# Altium schematic sheet G11_Main.SCHDOC
size A3; SheetNumber: 0; SheetTotal: 0
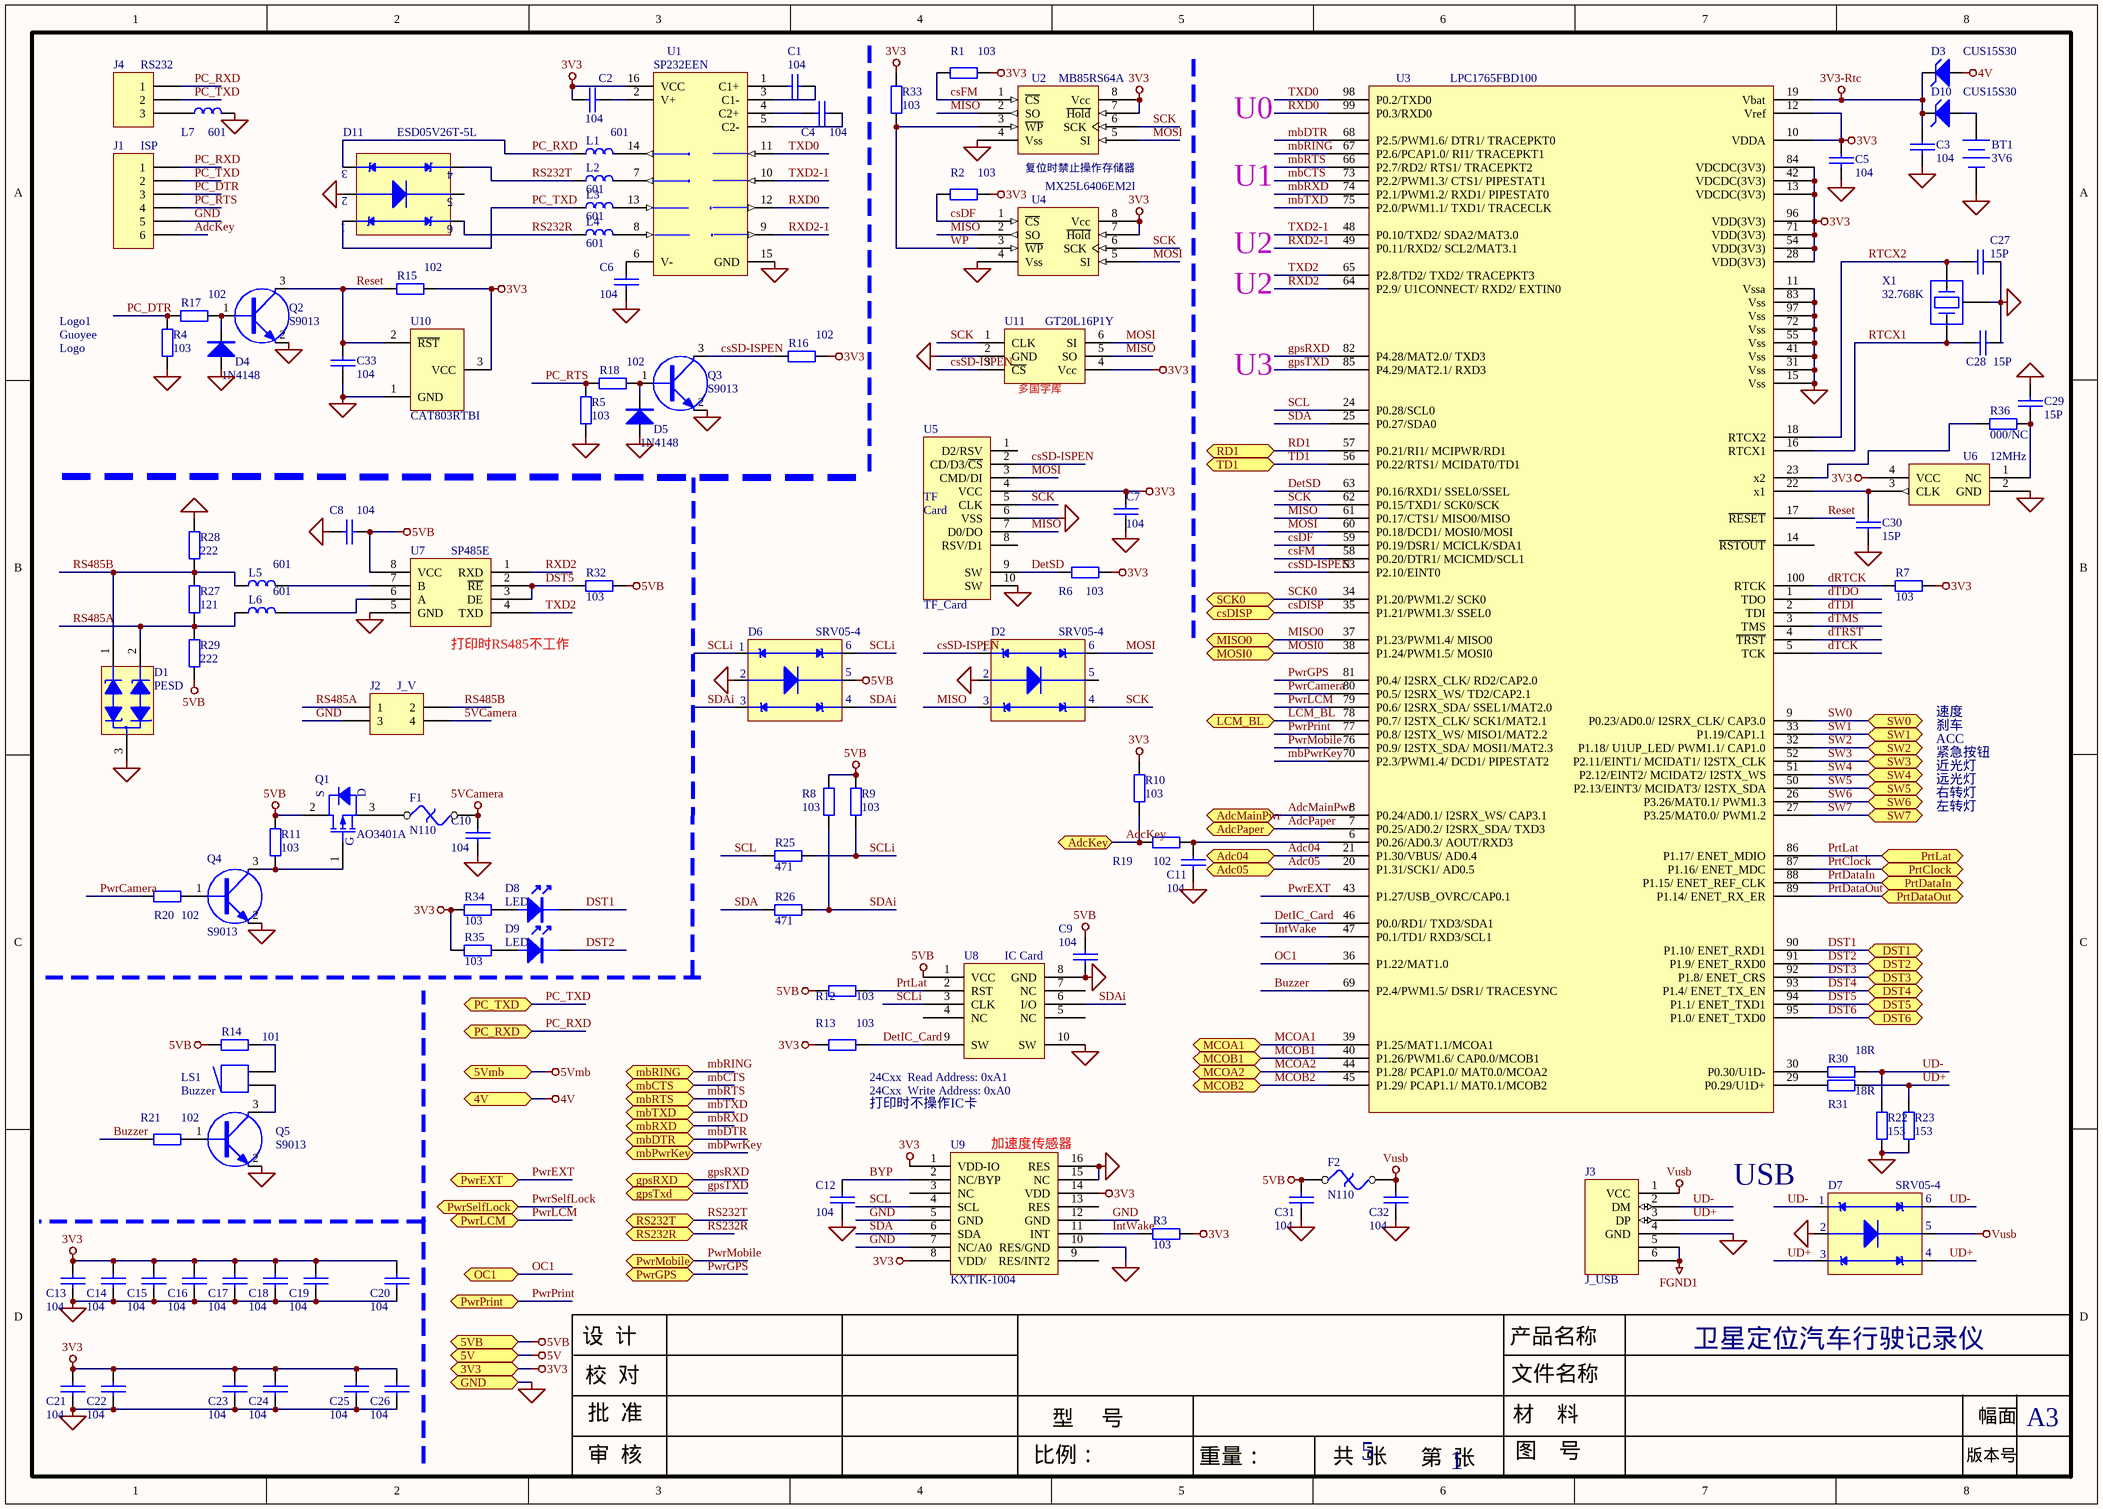
[diagram p0: G11_Main.SCHDOC]

## Parts
BT1  3V6  [BAT3V-33*20]
C1  104  [C0603]
C2  104  [C0603]
C3  104  [C0603]
C4  104  [C0603]
C5  104  [C0603]
C6  104  [C0603]
C7  104  [C0603]
C8  104  [C0603]
C9  104  [C0603]
C10  104  [C0603]
C11  104  [C0603]
C12  104  [C0603]
C13  104  [C0603]
C14  104  [C0603]
C15  104  [C0603]
C16  104  [C0603]
C17  104  [C0603]
C18  104  [C0603]
C19  104  [C0603]
C20  104  [C0603]
C21  104  [C0603]
C22  104  [C0603]
C23  104  [C0603]
C24  104  [C0603]
C25  104  [C0603]
C26  104  [C0603]
C27  15P  [C0603]
C28  15P  [C0603]
C29  15P  [C0603]
C30  15P  [C0603]
C31  104  [C0603]
C32  104  [C0603]
C33  104  [C0603]
D1  PESD  [SOT-233]
D2  SRV05-4  [SOT-236]
D3  CUS15S30  [D1206]
D4  1N4148  [D1206]
D5  1N4148  [D1206]
D6  SRV05-4  [SOT-236]
D7  SRV05-4  [SOT-236]
D8  LED  [R0603]
D9  LED  [R0603]
D10  CUS15S30  [D1206]
D11  ESD05V26T-5L  [SOT-236]
F1  N110  [F0820]
F2  N110  [F0820]
J1  ISP  [HDR1X6-2.0]
J2  J_V  [HDR2X2-3mm]
J3  J_USB  [USB-A1]
J4  RS232  [HDR1X3-2.0]
L1  601  [0603]
L2  601  [0603]
L3  601  [0603]
L4  601  [0603]
L5  601  [0603]
L6  601  [0603]
L7  601  [0603]
Logo1  Logo  [Logo1]
LS1  Buzzer  [Buzzer]
Q1  AO3401A  [SOT-233PM]
Q2  S9013  [SOT-233]
Q3  S9013  [SOT-233]
Q4  S9013  [SOT-233]
Q5  S9013  [SOT-233]
R1  103  [R0603]
R2  103  [R0603]
R3  103  [R0603]
R4  103  [R0603]
R5  103  [R0603]
R6  103  [R0603]
R7  103  [R0603]
R8  103  [R0603]
R9  103  [R0603]
R10  103  [R0603]
R11  103  [R0603]
R12  103  [R0603]
R13  103  [R0603]
R14  101  [R0603]
R15  102  [R0603]
R16  102  [R0603]
R17  102  [R0603]
R18  102  [R0603]
R19  102  [R0603]
R20  102  [R0603]
R21  102  [R0603]
R22  153  [R0603]
R23  153  [R0603]
R25  471  [R0603]
R26  471  [R0603]
R27  121  [R0603]
R28  222  [R0603]
R29  222  [R0603]
R30  18R  [R0603]
R31  18R  [R0603]
R32  103  [R0603]
R33  103  [R0603]
R34  103  [R0603]
R35  103  [R0603]
R36  000/NC  [R0603]
U1  SP232EEN  [SO-G16/G6.9]
U2  MB85RS64A  [SMD8A]
U3  LPC1765FBD100  [LQFP100]
U4  MX25L6406EM2I  [SOIC8-208mil]
U5  TF_Card  [TF_Card]
U6  12MHz  [XTAL3.2*2.5]
U7  SP485E  [SMD8A]
U8  IC Card  [IC_CARD-S1]
U9  KXTIK-1004  [LGA-3*3*0.9]
U10  CAT803RTBI  [SOT-233]
U11  GT20L16P1Y  [SOT-236]
X1  32.768K  [32K768]

## Ports
3V3 (bidir), 4V (bidir), 5V (bidir), 5VB (bidir), 5Vmb (bidir), Adc04, Adc05, AdcKey, AdcMainPwr, AdcPaper, csDISP, DST1 (bidir), DST2 (bidir), DST3 (bidir), DST4 (bidir), DST5 (bidir), DST6 (bidir), GND (bidir), gpsRXD (bidir), gpsTxd (bidir), LCM_BL (bidir), mbCTS (bidir), mbDTR (bidir), mbPwrKey (bidir), mbRING (bidir), mbRTS (bidir), mbRXD (bidir), mbTXD (bidir), MCOA1, MCOA2, MCOB1, MCOB2, MISO0, MOSI0, OC1, PC_RXD (bidir), PC_TXD (bidir), PrtClock, PrtDataIn, PrtDataOut, PrtLat, PwrEXT (bidir), PwrGPS (bidir), PwrLCM, PwrMobile (bidir), PwrPrint, PwrSelfLock, RD1, RS232R (bidir), RS232T (bidir), SCK0, SW0 (bidir), SW1 (bidir), SW2 (bidir), SW3 (bidir), SW4 (bidir), SW5 (bidir), SW6 (bidir), SW7 (bidir), TD1

## Nets
3V3: C2.1 C5.1 C7.1 C13.1 C14.1 C15.1 C16.1 C17.1 C18.1 C19.1 C20.1 C21.1 C22.1 C23.1 C24.1 C25.1 C26.1 R1.2 R2.2 R3.1 R6.2 R7.2 R10.2 R13.2 R15.2 R16.2 R33.2 R34.1 R35.1 U1.16(VCC) U2.7(~{Hold}) U2.8(Vcc) U3.10(VDDA) U3.12(Vref) U3.13(VDCDC(3V3)) U3.28(VDD(3V3)) U3.42(VDCDC(3V3)) U3.54(VDD(3V3)) U3.71(VDD(3V3)) U3.84(VDCDC(3V3)) U3.96(VDD(3V3)) U4.7(~{Hold}) U4.8(Vcc) U5.4(VCC) U6.4(VCC) U9.1(VDD-IO) U9.8(VDD/) U9.14(VDD) U10.3(VCC) U11.4(Vcc) ; port 3V3
3V3-Rtc: C3.1 D3.2(K) D10.2(K) U3.19(Vbat)
4V: D3.1(A) ; port 4V
5V: port 5V
5VB: C8.1 C9.1 C31.1 D6.5 F2.1 Q1.2(D) R8.2 R9.2 R11.1 R12.2 R14.2 R29.1 R32.1 U7.8(VCC) U8.1(VCC) ; port 5VB
5VCamera: C10.1 F1.1 J2.4
5Vmb: port 5Vmb
FGND1: J3.5 J3.6
GND: BT1.2(-) C3.2 C5.2 C6.1 C7.2 C8.2 C9.2 C10.2 C11.2 C12.1 C13.2 C14.2 C15.2 C16.2 C17.2 C18.2 C19.2 C20.2 C21.2 C22.2 C23.2 C24.2 C25.2 C26.2 C27.1 C28.1 C29.2 C30.1 C31.2 C32.2 C33.2 D1.3 D2.2 D4.1 D5.1 D6.2 D7.2 D11.2 J1.5 J2.3 J3.4(GND) L7.2 Q2.2(E) Q3.2(E) Q4.2(E) Q5.2(E) R4.1 R5.1 R22.2 R23.2 R28.2 U1.15(GND) U2.4(Vss) U3.11(Vssa) U3.15(Vss) U3.31(Vss) U3.41(Vss) U3.55(Vss) U3.72(Vss) U3.83(Vss) U3.97(Vss) U4.4(Vss) U5.6(VSS) U5.10(SW) U6.2(GND) U7.5(GND) U8.8(GND) U8.10(SW) U9.5(GND) U9.7(NC/A0) U9.10(RES/GND) U9.12(GND) U9.15(NC) U9.16(RES) U10.1(GND) U11.2(GND) X1.0 ; port GND
Vusb: C32.1 D7.5 F2.2 J3.1(VCC)
Adc04: U3.21(P1.30/VBUS/
AD0.4) ; port Adc04
Adc05: U3.20(P1.31/SCK1/
AD0.5) ; port Adc05
AdcKey: J1.6 R10.1 R19.1 ; port AdcKey
AdcMainPwr: U3.8(P0.24/AD0.1/
I2SRX_WS/
CAP3.1) ; port AdcMainPwr
AdcPaper: U3.7(P0.25/AD0.2/
I2SRX_SDA/
TXD3) ; port AdcPaper
Buzzer: R21.1 U3.69(P2.4/PWM1.5/
DSR1/
TRACESYNC)
BYP: C12.2 U9.2(NC/BYP)
csDF: R2.1 U3.59(P0.19/DSR1/
MCICLK/SDA1) U4.1(~{CS})
csDISP: U3.35(P1.21/PWM1.3/
SSEL0) ; port csDISP
csFM: R1.1 U2.1(~{CS}) U3.58(P0.20/DTR1/
MCICMD/SCL1)
csSD-ISPEN: D2.1 Q3.3(C) R16.1 U3.53(P2.10/EINT0) U5.2(CD/D3/~{CS}) U11.3(~{CS})
DetIC_Card: R13.1 U3.46(P0.0/RD1/
TXD3/SDA1) U8.9(SW)
DetSD: R6.1 U3.63(P0.16/RXD1/
SSEL0/SSEL) U5.9(SW)
dRTCK: R7.1 U3.100(RTCK)
DST1: D8.2(K) U3.90(P1.10/
ENET_RXD1) ; port DST1
DST2: D9.2(K) U3.91(P1.9/
ENET_RXD0) ; port DST2
DST3: U3.92(P1.8/
ENET_CRS) ; port DST3
DST4: U3.93(P1.4/
ENET_TX_EN) ; port DST4
DST5: R32.2 U3.94(P1.1/
ENET_TXD1) U7.2(~{RE}) U7.3(DE) ; port DST5
DST6: U3.95(P1.0/
ENET_TXD0) ; port DST6
dTCK: U3.5(TCK)
dTDI: U3.2(TDI)
dTDO: U3.1(TDO)
dTMS: U3.3(TMS)
dTRST: U3.4(~{TRST})
gpsRXD: U3.82(P4.28/MAT2.0/
TXD3) ; port gpsRXD
gpsTXD: U3.85(P4.29/MAT2.1/
RXD3) ; port gpsTxd
IntWake: R3.2 U3.47(P0.1/TD1/
RXD3/SCL1) U9.11(INT)
LCM_BL: U3.78(P0.7/
I2STX_CLK/
SCK1/MAT2.1) ; port LCM_BL
mbCTS: U3.73(P2.2/PWM1.3/
CTS1/
PIPESTAT1) ; port mbCTS
mbDTR: U3.68(P2.5/PWM1.6/
DTR1/
TRACEPKT0) ; port mbDTR
mbPwrKey: U3.70(P2.3/PWM1.4/
DCD1/
PIPESTAT2) ; port mbPwrKey
mbRING: U3.67(P2.6/PCAP1.0/
RI1/
TRACEPKT1) ; port mbRING
mbRTS: U3.66(P2.7/RD2/
RTS1/
TRACEPKT2) ; port mbRTS
mbRXD: U3.74(P2.1/PWM1.2/
RXD1/
PIPESTAT0) ; port mbRXD
mbTXD: U3.75(P2.0/PWM1.1/
TXD1/
TRACECLK) ; port mbTXD
MCOA1: U3.39(P1.25/MAT1.1/MCOA1) ; port MCOA1
MCOA2: U3.44(P1.28/
PCAP1.0/
MAT0.0/MCOA2) ; port MCOA2
MCOB1: U3.40(P1.26/PWM1.6/
CAP0.0/MCOB1) ; port MCOB1
MCOB2: U3.45(P1.29/
PCAP1.1/
MAT0.1/MCOB2) ; port MCOB2
MISO: D2.3 U2.2(SO) U3.61(P0.17/CTS1/
MISO0/MISO) U4.2(SO) U5.7(D0/DO) U11.5(SO)
MISO0: U3.37(P1.23/PWM1.4/
MISO0) ; port MISO0
MOSI: D2.6 U2.5(SI) U3.60(P0.18/DCD1/
MOSI0/MOSI) U4.5(SI) U5.3(CMD/DI) U11.6(SI)
MOSI0: U3.38(P1.24/PWM1.5/
MOSI0) ; port MOSI0
OC1: U3.36(P1.22/MAT1.0) ; port OC1
PC_DTR: J1.3 R4.2 R17.1
PC_RTS: J1.4 R5.2 R18.1
PC_RXD: D11.3 J1.1 J4.1 L1.1 ; port PC_RXD
PC_TXD: D11.1 J1.2 J4.2 L3.1 ; port PC_TXD
PrtClock: U3.87(P1.16/
ENET_MDC) ; port PrtClock
PrtDataIn: U3.88(P1.15/
ENET_REF_CLK) ; port PrtDataIn
PrtDataOut: U3.89(P1.14/
ENET_RX_ER) ; port PrtDataOut
PrtLat: R12.1 U3.86(P1.17/
ENET_MDIO) U8.2(RST) ; port PrtLat
PwrCamera: R20.2 U3.80(P0.5/
I2SRX_WS/
TD2/CAP2.1)
PwrEXT: U3.43(P1.27/USB_OVRC/CAP0.1) ; port PwrEXT
PwrGPS: U3.81(P0.4/
I2SRX_CLK/
RD2/CAP2.0) ; port PwrGPS
PwrLCM: U3.79(P0.6/
I2SRX_SDA/
SSEL1/MAT2.0) ; port PwrLCM
PwrMobile: U3.76(P0.9/
I2STX_SDA/
MOSI1/MAT2.3) ; port PwrMobile
PwrPrint: U3.77(P0.8/
I2STX_WS/
MISO1/MAT2.2) ; port PwrPrint
PwrSelfLock: port PwrSelfLock
RD1: U3.57(P0.21/RI1/
MCIPWR/RD1) ; port RD1
Reset: C33.1 Q2.3(C) R15.1 U3.17(~{RESET}) U10.2(~{RST})
RS232R: D11.6 L4.1 ; port RS232R
RS232T: D11.4 L2.1 ; port RS232T
RS485A: D1.2 J2.1 L6.1 R27.1 R29.2
RS485B: D1.1 J2.2 L5.1 R27.2 R28.1
RTCX1: C28.2 U3.16(RTCX1) X1.1
RTCX2: C27.2 U3.18(RTCX2) X1.2
RXD0: U1.12(R1OUT) U3.99(P0.3/RXD0)
RXD2: U3.64(P2.9/
U1CONNECT/
RXD2/
EXTIN0) U7.1(RXD)
RXD2-1: U1.9(R2OUT) U3.49(P0.11/RXD2/
SCL2/MAT3.1)
SCK: D2.4 U2.6(SCK) U3.62(P0.15/TXD1/
SCK0/SCK) U4.6(SCK) U5.5(CLK) U11.1(CLK)
SCK0: U3.34(P1.20/PWM1.2/
SCK0) ; port SCK0
SCL: R25.2 U3.24(P0.28/SCL0) U9.4(SCL)
SCLi: D6.1 D6.6 R9.1 R25.1 U8.3(CLK)
SDA: R26.2 U3.25(P0.27/SDA0) U9.6(SDA)
SDAi: D6.3 D6.4 R8.1 R26.1 U8.6(I/O)
SW0: U3.9(P0.23/AD0.0/
I2SRX_CLK/
CAP3.0) ; port SW0
SW1: U3.33(P1.19/CAP1.1) ; port SW1
SW2: U3.32(P1.18/
U1UP_LED/
PWM1.1/
CAP1.0) ; port SW2
SW3: U3.52(P2.11/EINT1/
MCIDAT1/
I2STX_CLK) ; port SW3
SW4: U3.51(P2.12/EINT2/
MCIDAT2/
I2STX_WS) ; port SW4
SW5: U3.50(P2.13/EINT3/
MCIDAT3/
I2STX_SDA) ; port SW5
SW6: U3.26(P3.26/MAT0.1/
PWM1.3) ; port SW6
SW7: U3.27(P3.25/MAT0.0/
PWM1.2) ; port SW7
TD1: U3.56(P0.22/RTS1/
MCIDAT0/TD1) ; port TD1
TXD0: U1.11(T1IN) U3.98(P0.2/TXD0)
TXD2: U3.65(P2.8/TD2/
TXD2/
TRACEPKT3) U7.4(TXD)
TXD2-1: U1.10(T2IN) U3.48(P0.10/TXD2/
SDA2/MAT3.0)
UD+: D7.3 D7.4 J3.3(DP) R23.1 R31.1
UD-: D7.1 D7.6 J3.2(DM) R22.1 R30.1
WP: R33.1 U2.3(~{WP}) U4.3(~{WP})
NetBT1_1: BT1.1(+) D10.1(A)
NetC1_1: C1.1 U1.1(C1+)
NetC1_2: C1.2 U1.3(C1-)
NetC2_2: C2.2 U1.2(V+)
NetC4_1: C4.1 U1.4(C2+)
NetC4_2: C4.2 U1.5(C2-)
NetC6_2: C6.2 U1.6(V-)
NetC11_1: C11.1 R19.2 U3.6(P0.26/AD0.3/
AOUT/RXD3)
NetC29_1: C29.1 R36.2 U6.1(NC)
NetC30_2: C30.2 U3.22(x1) U6.3(CLK)
NetD4_2: D4.2 Q2.1(B) R17.2
NetD5_2: D5.2 Q3.1(B) R18.2
NetD8_1: D8.1(A) R34.2
NetD9_1: D9.1(A) R35.2
NetF1_2: F1.2 Q1.3(S)
NetJ4_3: J4.3 L7.1
NetL1_2: L1.2 U1.14(T1OUT)
NetL2_2: L2.2 U1.7(T2OUT)
NetL3_2: L3.2 U1.13(R1IN)
NetL4_2: L4.2 U1.8(R2IN)
NetL5_2: L5.2 U7.7(B)
NetL6_2: L6.2 U7.6(A)
NetLS1_1: LS1.1 Q5.3(C)
NetLS1_2: LS1.2 R14.1
NetQ1_1: Q1.1(G) Q4.3(C) R11.2
NetQ4_1: Q4.1(B) R20.1
NetQ5_1: Q5.1(B) R21.2
NetR30_2: R30.2 U3.30(P0.30/U1D-)
NetR31_2: R31.2 U3.29(P0.29/U1D+)
NetR36_1: R36.1 U3.23(x2)

Not connected (* = marked no-connect by the designer): D2 5; D11 5; U3 14(~{RSTOUT}); U5 1(D2/RSV) 8(RSV/D1); U8 4(NC) 5(NC) 7(NC); U9 3(NC) 9(RES/INT2) 13(RES)

## Notes on the sheet
- (near U2) 复位时禁止操作存储器
- U0
- U1
- U2
- U3
- (near U11) 多国字库
- (near U7) 打印时RS485不工作
- 速度
- 刹车
- ACC
- 紧急按钮
- 近光灯
- 远光灯
- 左转灯
- 右转灯
- 24Cxx  Read Address: 0xA1
- 24Cxx  Write Address: 0xA0
- 打印时不操作IC卡
- (near U9) 加速度传感器
- USB
- 设  计
- 校  对
- 产品名称
- 文件名称
- 卫星定位汽车行驶记录仪
- 审  核
- 批  准
- 比例：
- 型     号
- 5
- 材    料
- 图    号
- 版本号
- 幅面
- A3
- 重量：
- 共  张
- 第  张
- 1
- (in symbol Logo) Guoyee
- (in symbol TF_Card) TF; Card

## Library data of the parts
BT1 = Battery: 直插时钟电池; Manufacturer: Generic Components; Published: 1999
C1-C33 = CAP: 贴片电容
  C1 C2 C4 C6 C12 C27-C30: C: 贴片电容
  C8 C33: Cap: Cap
D1 = PESD1CAN: 贴片防静电管
D2 D6 D7 D11 = ESD4: 贴片ESD管; Manufacturer: Generic Components; Class: Discrete; SubClass: Diode - Zener; Published: 08/06/2000; Publisher: Altium Hobart Technology Centre
D3 D10 = D Zener: 贴片二极管; Manufacturer: Generic Components; Class: Discrete; SubClass: Diode - Zener; Published: 08/06/2000; Publisher: Altium Hobart Technology Centre
D4 D5 = DIODE: 贴片二极管; D: Didoe
D8 D9 = LED: 贴片红极发光二极管; LED: m3 LED
F1 F2 = THERMAL FUSE: 贴片自恢复保险丝; F: F
J1 = Header 6: Header, 6-Pin; Revision: 17-Jul-2002: Re-released for DXP Platform.; Publisher: Altium Limited
J2 = Header 2X2: 3.0直插弯头2X2插座; Revision: 17-Jul-2002: Re-released for DXP Platform.; Publisher: Altium Limited
J3 = USB: 竖焊USB-A型座
J4 = Header 3: Header, 3-Pin; Revision: 17-Jul-2002: Re-released for DXP Platform.; Publisher: Altium Limited
L1-L7 = ChiZhu: 贴片磁珠; Manufacturer: Generic Components; Class: Passive; SubClass: Inductor; Published: 08/06/2000; Publisher: Altium Hobart Technology Centre; Value: 601
LS1 = Buzzer: 蜂鸣器; Revision 1: Jul-2002: Re-released for DXP Platform.; Revision 2: 17-Dec-2003: Schematic revised, PCB Footprint replaced.; Published: 17-Dec-2003; Datasheet: Latest Revision: 17-Dec-2003; Publisher: Altium Limited
Q1 = MOSFET-P: 贴片P沟MOS管
Q2 Q3 Q5 = 9013: 贴片三极管
Q4 = 9013
R1-R23 R25-R36 = Res2: 贴片电阻; Manufacturer: Generic Components; Class: Passive; SubClass: Resistor; Value: 15K; Published: 08/06/2000; Publisher: Altium Hobart Technology Centre
U1 = MAX3232EEWE: 贴片通讯IC; Manufacturer: Maxim; Class: Communication; SubClass: Transceiver; Published: 16/01/2001; Publisher: Altium Hobart Technology Centre
U2 U4 = FM25xx: 贴片IC存储器; FRAM: EEPROM WatchDog(贴片)
U3 = LPC236x: 贴处IC处理器
U5 = TF_Card: TF卡座
U6 = CrysVcc: 贴片有源晶振
U7 = MAX485: 贴片通讯IC
U8 = 4442Card: IC卡座
U9 = KXTIK-1004: 贴片传感器
U10 = CAT803: 贴片复位IC
X1 = CRYSTAL: 无源晶振